# Altium schematic sheet powerSupply.SchDoc
size A; SheetNumber: 2; SheetTotal: 2
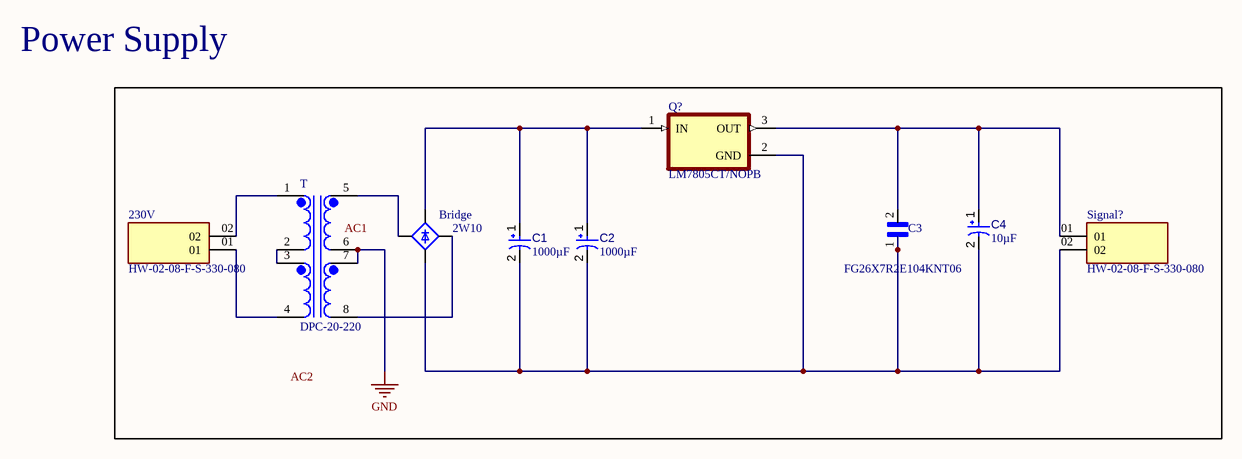
[diagram p0: powerSupply.SchDoc]

## Parts
230V  HW-02-08-F-S-330-080  [SAMTEC_HW-02-08-F-S-330-080]
Bridge  2W10  [2W10]
C1  value 1000µF  [CAPPR65-350-1150X800X1250]  (hidden comment: ECA1HM101)
C2  value 1000µF  [CAPPR65-350-1150X800X1250]  (hidden comment: ECA1HM101)
C3  FG26X7R2E104KNT06  [CAPRB500W50L550T350H600]
C4  value 10µF  [CAPPR65-350-1150X800X1250]  (hidden comment: ECA1HM101)
Q?  LM7805CT/NOPB  [TO254P1054X470X2600-3]
Signal?  HW-02-08-F-S-330-080  [SAMTEC_HW-02-08-F-S-330-080]
T  DPC-20-220  [XFMR_DPC-20-220]

## Nets
GND: T.6 T.7
Net230V_01: 230V.01 T.4
Net230V_02: 230V.02 T.1
NetBridge_+VCC: Bridge.+VCC C1.1 C2.1 Q?.1(IN)
NetBridge_-VDD: Bridge.-VDD C1.2 C2.2 C3.1 C4.2 Q?.2(GND) Signal?.02
NetBridge_AC1: Bridge.AC1 T.5
NetBridge_AC2: Bridge.AC2 T.8
NetC3_2: C3.2 C4.1 Q?.3(OUT) Signal?.01
NetT_2: T.2 T.3

## Notes on the sheet
- Power Supply
- Labels drawn without touching a wire or pin: AC1, AC2

## Library data of the parts
Bridge = 2W10: Bridge Rectifier Single Phase Standard 1 kV Through Hole WOM; MF: MDD; SnapEDA_Link: https://www.snapeda.com/parts/2W10/MDD/view-part/?ref=snap; Package: None; Value: *; MP: 2W10; Check_prices: https://www.snapeda.com/parts/2W10/MDD/view-part/?ref=eda
C1 C2 C4 = CMP-001-00026-7: Aluminum Electrolytic Capacitor, 100 uF, +/- 20%, 50 V, -40 to 85 degC, 2-Pin THD, RoHS, Bulk; Manufacturer: Panasonic; Voltage Rating: 50V; Ripple Current: 250mA; Datasheet URL: https://industrial.panasonic.com/cdbs/www-data/pdf/RDF0000/ABA0000C1218.pdf; Lead Pitch: 3.5mm; Mounting Technology: TH; Package Description: 2-Pin Radial Lead, Dia 8 mm, Height 12.5 mm; Diameter: 8mm; Ripple Current (AC): 250mA; Manufacturer URL: http://www.panasonic.com/; Capacitor Type: Electrolytic; Max Operating Temperature: 85°C; Pins: 2; Min Operating Temperature: -40°C; Tolerance: 20%; Case/Package: Radial; Packaging: Bulk; Package Quantity: 200; Package Reference: CAPPR65-350-1150X800X1250; RoHS Compliant: True; Datasheet Version: Rev. 05, 10/2016
C3 = FG26X7R2E104KNT06: 0.1ÂµF Â±10% 250V Ceramic Capacitor X7R Radial; MF: TDK; Purchase-URL: https://pricing.snapeda.com/search/part/FG26X7R2E104KNT06/?ref=eda; Package: Radial TDK; Availability: In Stock; Value: *; MP: FG26X7R2E104KNT06; Check_prices: https://www.snapeda.com/parts/FG26X7R2E104KNT06/TDK/view-part/?ref=eda; Price: None; SnapEDA_Link: https://www.snapeda.com/parts/FG26X7R2E104KNT06/TDK/view-part/?ref=snap
Q? = LM7805CT/NOPB: Linear Voltage Regulator IC Positive Fixed 1 Output 1.5A TO-220-3; MF: ON Semiconductor; Purchase-URL: https://pricing.snapeda.com/search/part/LM7805CT/?ref=eda; Check_prices: https://www.snapeda.com/parts/LM7805CT/Onsemi/view-part/?ref=eda; SnapEDA_Link: https://www.snapeda.com/parts/LM7805CT/Onsemi/view-part/?ref=snap; Price: None; Availability: In Stock; Package: TO-220-3 ON Semiconductor; MP: LM7805CT; Value: *
T = DPC-20-220: Low Power Miniature Transformer | 4.4VA Power | 115V/230V Input | 10VCT Output Series; Package: None; Price: None; Value: *; MP: DPC-20-220; Availability: Unavailable
230V Signal? = HW-02-08-F-S-330-080: Availability: Unavailable; Price: None; Package: None; MP: HW-02-08-F-S-330-080; Value: *